# Altium schematic sheet CP2102.SchDoc
size A4; SheetNumber: 3; SheetTotal: 5
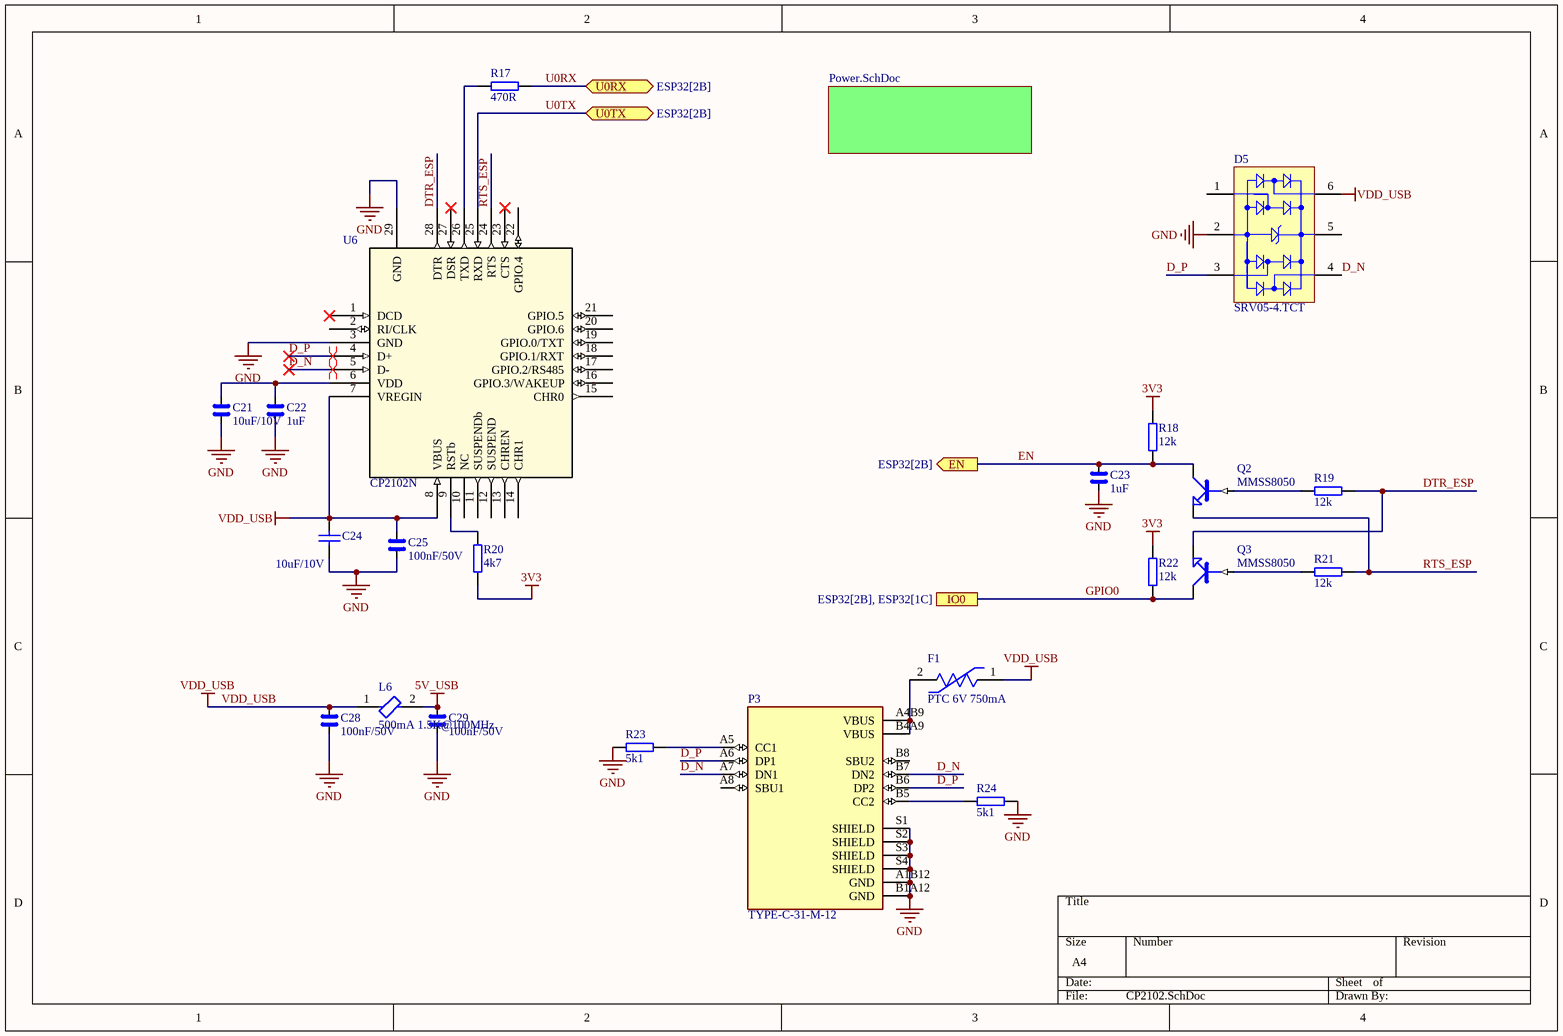
[diagram p0: CP2102.SchDoc]

## Parts
C21  10uF/10V  [1608[0603]]
C22  1uF  [1608[0603]]
C23  1uF  [1608[0603]]
C24  10uF/10V  [1608[0603]]
C25  100nF/50V  [1608[0603]]
C28  100nF/50V  [1608[0603]]
C29  100nF/50V  [1608[0603]]
D5  SRV05-4.TCT  [SMTC-SOT23-6_V]
F1  PTC 6V 750mA  [FP-1206L050YR-MFG]
L6  500mA 1.5K@100MHz  [1608[0603]]
P3  TYPE-C-31-M-12  [HRO_TYPE-C-31-M-12-3D]
Q2  MMSS8050  [SOT-23]
Q3  MMSS8050  [SOT-23]
R17  470R  [1608[0603]]
R18  12k  [1608[0603]]
R19  12k  [1608[0603]]
R20  4k7  [1608[0603]]
R21  12k  [1608[0603]]
R22  12k  [1608[0603]]
R23  5k1  [1608[0603]]
R24  5k1  [1608[0603]]
U6  CP2102N  [QFN28_5X5_SIL]

## Sub-sheets
? = Power.SchDoc: no entries

## Ports
EN (out, see ESP32[2B]), IO0 (see ESP32[2B], ESP32[1C]), U0RX (bidir, see ESP32[2B]), U0TX (bidir, see ESP32[2B])

## Nets
3V3: R18.2 R20.1 R22.2
5V_USB: C29.1 L6.2
GND: C21.2 C22.2 C23.2 C24.1 C25.2 C28.2 C29.2 D5.2(GND) P3.A1B12(GND) P3.B1A12(GND) P3.S1(SHIELD) P3.S2(SHIELD) P3.S3(SHIELD) P3.S4(SHIELD) R23.2 R24.1 U6.3(GND) U6.29(GND)
VDD_USB: C24.2 C25.1 C28.1 D5.6(I/O_4) F1.1 L6.1 U6.7(VREGIN) U6.8(VBUS)
D_N: D5.4(I/O_3) P3.A7(DN1) P3.B7(DN2) U6.5(D-)
D_P: D5.3(I/O_2) P3.A6(DP1) P3.B6(DP2) U6.4(D+)
DTR_ESP: Q3.2(E) R19.2 U6.28(DTR)
EN: C23.1 Q2.3(C) R18.1 ; port EN
GPIO0: Q3.3(C) R22.1 ; port IO0
RTS_ESP: Q2.2(E) R21.2 U6.24(RTS)
U0RX: R17.1 ; port U0RX
U0TX: U6.25(RXD) ; port U0TX
NetC21_1: C21.1 C22.1 U6.6(VDD)
NetF1_2: F1.2 P3.A4B9(VBUS) P3.B4A9(VBUS)
NetP3_A5: P3.A5(CC1) R23.1
NetP3_B5: P3.B5(CC2) R24.2
NetQ2_1: Q2.1(B) R19.1
NetQ3_1: Q3.1(B) R21.1
NetR17_2: R17.2 U6.26(TXD)
NetR20_2: R20.2 U6.9(RSTb)

Not connected (* = marked no-connect by the designer): D5 1(I/O_1) 5(VBUS); P3 A8(SBU1) B8(SBU2); U6 1(DCD)* 2(RI/CLK) 10(NC) 11(SUSPENDb) 12(SUSPEND) 13(CHREN) 14(CHR1) 15(CHR0) 16(GPIO.3/WAKEUP) 17(GPIO.2/RS485) 18(GPIO.1/RXT) 19(GPIO.0/TXT) 20(GPIO.6) 21(GPIO.5) 22(GPIO.4) 23(CTS)* 27(DSR)*

## Layout directives
differential pair: D_N, D_P

## Library data of the parts
C21 = C: Capacitor; Supplier 1: Digi-Key; Supplier Part Number 1: 1276-1096-1-ND; Case/Package: 0603; LCSCPartNo: C19702
C22 C23 = C: CAP CER 1UF 10V X5R 0603; Supplier 1: Digi-Key; Supplier Part Number 1: 1276-1866-1-ND; Case/Package: 0603; LCSCPartNo: C15849
C24 = Cap: Capacitor; Supplier Part Number 1: 1276-1096-1-ND; Supplier 1: Digi-Key; LCSCPartNo: C19702; Case/Package: 0603
C25 C28 C29 = C: Cap Ceramic 0.1uF 50V X7R 20% SMD 0603 125C Paper T/R; Supplier 1: Digi-Key; Supplier Part Number 1: 1276-1941-1-ND; Case/Package: 0603; LCSCPartNo: C14663
D5 = CMP-2000-05358-1: RailClamp(R) Low Capacitance TVS Diode Array, 5 pF, 17.5 VC, -55 to 125 degC, 6-Pin SOT23, RoHS, Tape and Reel; Case/Package: SOT-23-6L; LCSCPartNo: C85364
F1 = CMP-08606-000073-1: PTC RESET FUSE 6V 750MA 1206; Case/Package: 1206; LCSCPartNo: C70078
L6 = CMP-0686-00368-3: Chip Ferrite Bead, 0603, 1500Ω @ 100MHz, 0.5Ω, 25%, 500mA; Case/Package: 0603; Supplier 1: Digi-Key; Supplier Part Number 1: 490-5216-1-ND; LCSCPartNo: C82155
P3 = TYPE-C-31-M-12: USB Connectors 24 Receptacle 1 8.94*7.3mm RoHS; LCSCPartNo: C165948
Q2 Q3 = NPN1: TRANS NPN 25V 1.5A SOT23; Supplier 1: Digi-Key; Supplier Part Number 1: MMSS8050-H-TPMSCT-ND; Case/Package: SOT-23; LCSCPartNo: C20526
R17 = R: YAGEO         RC0603FR-07470RL             SMD Chip Resistor, Thick Film, 470 ohm, 50 V, 0603 [1608 Metric], 100 mW,  1%, RC Series; Supplier 1: Digi-Key; Supplier Part Number 1: 311-470HRCT-ND; Case/Package: 0603; LCSCPartNo: C23179
R18 R19 R21 R22 = R: Res Thick Film 0603 12K Ohm 1% 1/10W 100ppm/C Molded SMD SMD Paper T/R; Supplier 1: Digi-Key; Supplier Part Number 1: 541-12.0KHCT-ND; Case/Package: 0603; LCSCPartNo: C22790
R20 = R: RES SMD 4.7K OHM 1% 1/10W 0603; Supplier 1: Digi-Key; Supplier Part Number 1: 311-4.70KHRCT-ND; Case/Package: 0603; LCSCPartNo: C23162
R23 R24 = R: Res Thick Film 0603 5.1KOhm 1% 1/10W 100ppm/C Molded SMD SMD Paper T/R; Supplier 1: Digi-Key; Case/Package: 0603; LCSCPartNo: C23186
U6 = CP2102N-A02-GQFN28: Full Speed USB to UART Bridge USB 2.0 3.3V Tube Automotive 28-Pin QFN EP; Supplier 1: Digi-Key; Supplier Part Number 1: 336-5889-ND; LCSCPartNo: C6568; Case/Package: QFN28